# EAGLE design led28 (EAGLE 6.2)
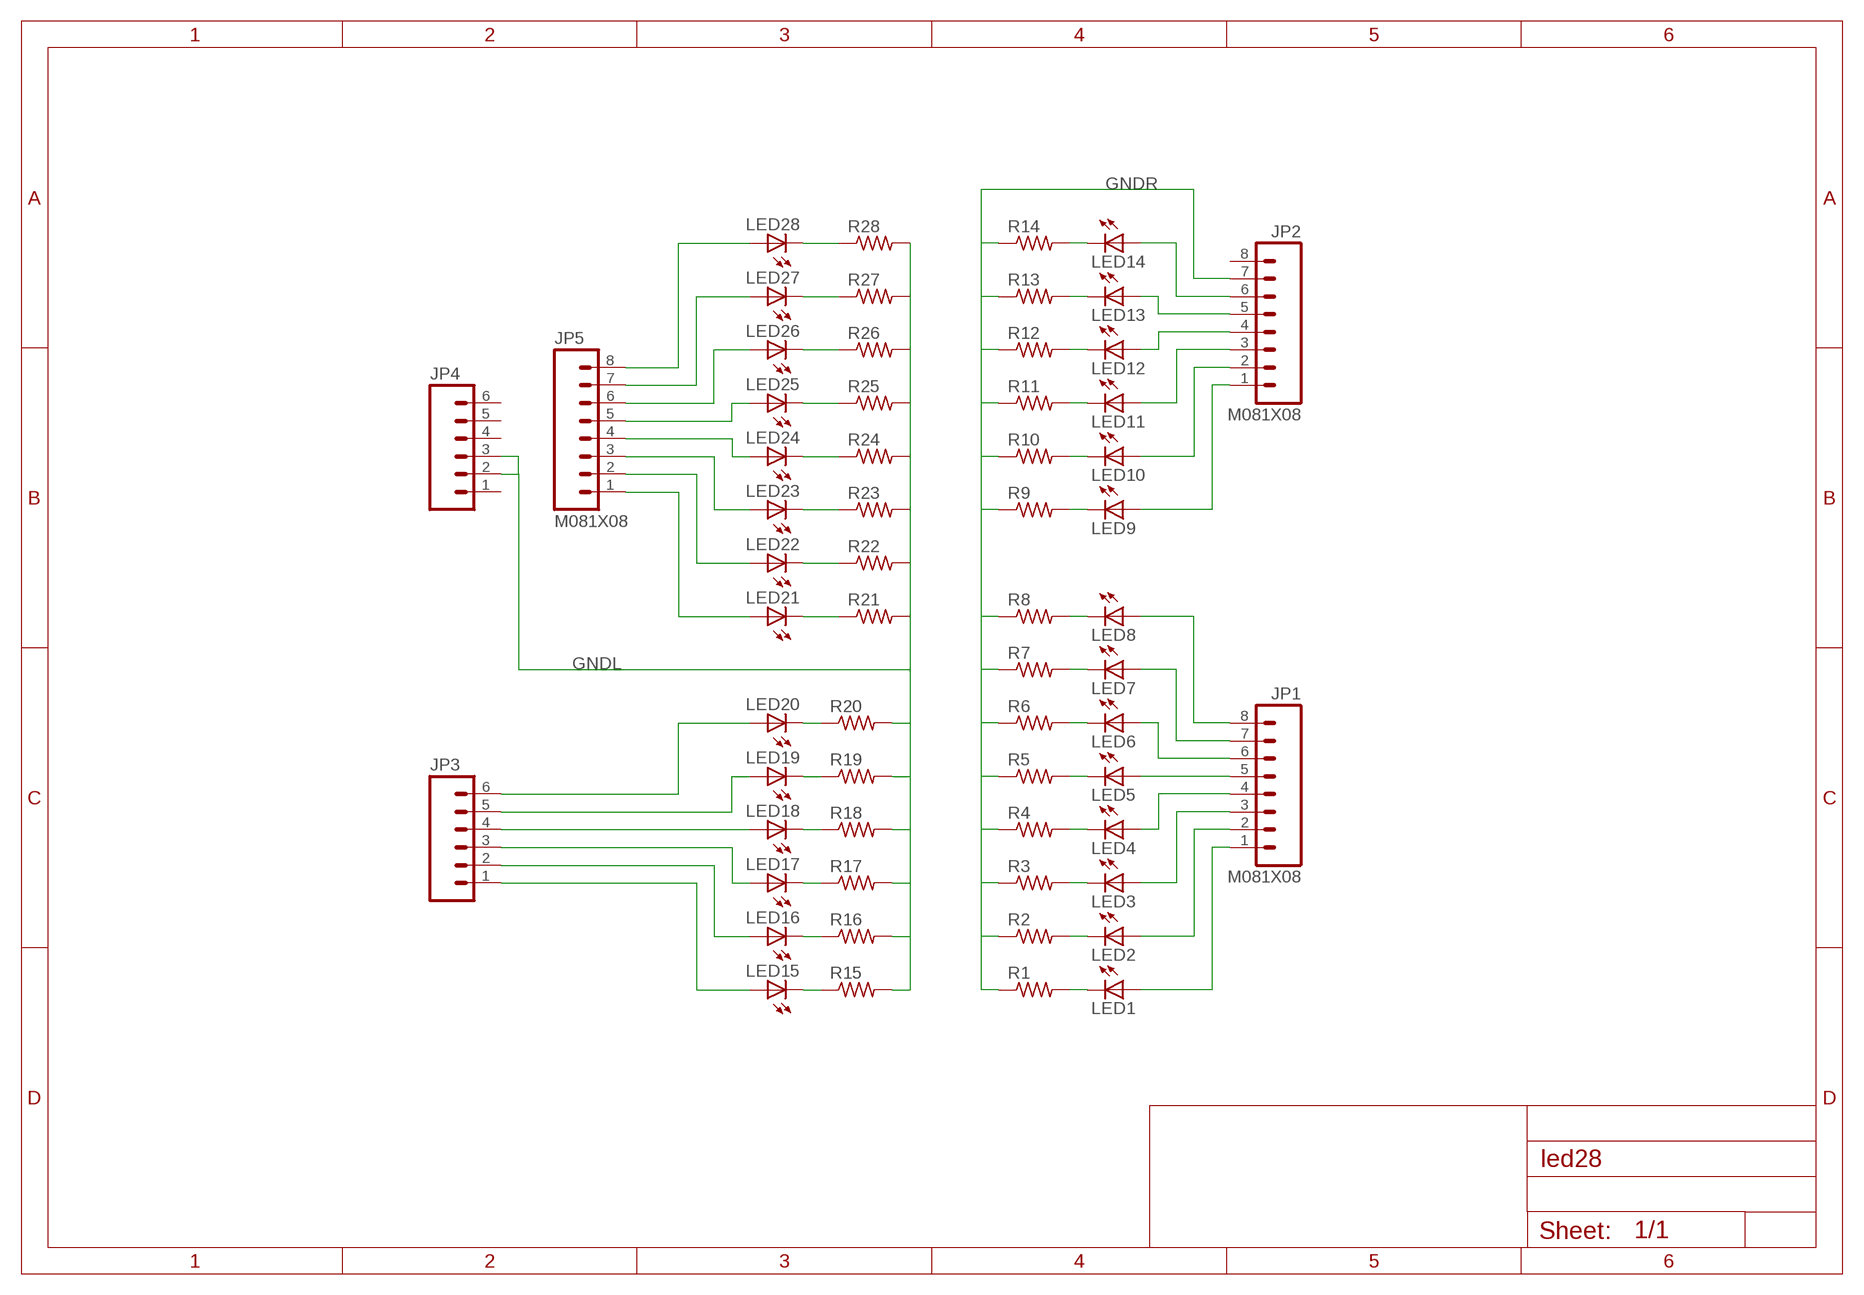
[diagram p0: schematic, sheet 1]

## Parts
JP1  M081X08  [1X08_NARROW]
JP2  M081X08  [1X08_NARROW]
JP3  M06SIP  [1X06_NARROW]
JP4  M06SIP  [1X06_NARROW]
JP5  M081X08  [1X08_NARROW]
LED1  LEDCHIP-LED0603  [CHIP-LED0603]
LED2  LEDCHIP-LED0603  [CHIP-LED0603]
LED3  LEDCHIP-LED0603  [CHIP-LED0603]
LED4  LEDCHIP-LED0603  [CHIP-LED0603]
LED5  LEDCHIP-LED0603  [CHIP-LED0603]
LED6  LEDCHIP-LED0603  [CHIP-LED0603]
LED7  LEDCHIP-LED0603  [CHIP-LED0603]
LED8  LEDCHIP-LED0603  [CHIP-LED0603]
LED9  LEDCHIP-LED0603  [CHIP-LED0603]
LED10  LEDCHIP-LED0603  [CHIP-LED0603]
LED11  LEDCHIP-LED0603  [CHIP-LED0603]
LED12  LEDCHIP-LED0603  [CHIP-LED0603]
LED13  LEDCHIP-LED0603  [CHIP-LED0603]
LED14  LEDCHIP-LED0603  [CHIP-LED0603]
LED15  LEDCHIP-LED0603  [CHIP-LED0603]
LED16  LEDCHIP-LED0603  [CHIP-LED0603]
LED17  LEDCHIP-LED0603  [CHIP-LED0603]
LED18  LEDCHIP-LED0603  [CHIP-LED0603]
LED19  LEDCHIP-LED0603  [CHIP-LED0603]
LED20  LEDCHIP-LED0603  [CHIP-LED0603]
LED21  LEDCHIP-LED0603  [CHIP-LED0603]
LED22  LEDCHIP-LED0603  [CHIP-LED0603]
LED23  LEDCHIP-LED0603  [CHIP-LED0603]
LED24  LEDCHIP-LED0603  [CHIP-LED0603]
LED25  LEDCHIP-LED0603  [CHIP-LED0603]
LED26  LEDCHIP-LED0603  [CHIP-LED0603]
LED27  LEDCHIP-LED0603  [CHIP-LED0603]
LED28  LEDCHIP-LED0603  [CHIP-LED0603]
R1  R-US_R0603  [R0603]
R2  R-US_R0603  [R0603]
R3  R-US_R0603  [R0603]
R4  R-US_R0603  [R0603]
R5  R-US_R0603  [R0603]
R6  R-US_R0603  [R0603]
R7  R-US_R0603  [R0603]
R8  R-US_R0603  [R0603]
R9  R-US_R0603  [R0603]
R10  R-US_R0603  [R0603]
R11  R-US_R0603  [R0603]
R12  R-US_R0603  [R0603]
R13  R-US_R0603  [R0603]
R14  R-US_R0603  [R0603]
R15  R-US_R0603  [R0603]
R16  R-US_R0603  [R0603]
R17  R-US_R0603  [R0603]
R18  R-US_R0603  [R0603]
R19  R-US_R0603  [R0603]
R20  R-US_R0603  [R0603]
R21  R-US_R0603  [R0603]
R22  R-US_R0603  [R0603]
R23  R-US_R0603  [R0603]
R24  R-US_R0603  [R0603]
R25  R-US_R0603  [R0603]
R26  R-US_R0603  [R0603]
R27  R-US_R0603  [R0603]
R28  R-US_R0603  [R0603]

## Nets
GNDL: JP4.2 JP4.3 R15.2 R16.2 R17.2 R18.2 R19.2 R20.2 R21.2 R22.2 R23.2 R24.2 R25.2 R26.2 R27.2 R28.2
GNDR: JP2.7 R1.1 R2.1 R3.1 R4.1 R5.1 R6.1 R7.1 R8.1 R9.1 R10.1 R11.1 R12.1 R13.1 R14.1
N$1: JP1.5 LED5.A
N$2: JP1.4 LED4.A
N$3: JP1.3 LED3.A
N$4: JP1.2 LED2.A
N$5: JP1.1 LED1.A
N$6: JP1.6 LED6.A
N$7: JP1.7 LED7.A
N$8: JP1.8 LED8.A
N$9: LED1.C R1.2
N$10: LED2.C R2.2
N$11: LED3.C R3.2
N$12: LED4.C R4.2
N$13: LED5.C R5.2
N$14: LED6.C R6.2
N$15: LED7.C R7.2
N$18: LED8.C R8.2
N$20: LED9.C R9.2
N$21: LED10.C R10.2
N$22: LED11.C R11.2
N$23: LED12.C R12.2
N$24: LED13.C R13.2
N$28: LED14.C R14.2
N$29: JP2.4 LED12.A
N$30: JP2.3 LED11.A
N$31: JP2.2 LED10.A
N$32: JP2.1 LED9.A
N$33: JP2.5 LED13.A
N$34: JP2.6 LED14.A
N$35: LED15.C R15.1
N$36: LED16.C R16.1
N$40: LED17.C R17.1
N$41: LED18.C R18.1
N$42: LED19.C R19.1
N$44: LED20.C R20.1
N$49: LED21.C R21.1
N$54: LED22.C R22.1
N$55: LED23.C R23.1
N$56: LED24.C R24.1
N$60: LED25.C R25.1
N$61: LED26.C R26.1
N$65: LED27.C R27.1
N$66: LED28.C R28.1
N$68: JP3.4 LED18.A
N$73: JP3.3 LED17.A
N$74: JP3.2 LED16.A
N$75: JP3.1 LED15.A
N$78: JP5.4 LED24.A
N$79: JP5.3 LED23.A
N$80: JP5.2 LED22.A
N$84: JP5.1 LED21.A
N$85: JP5.5 LED25.A
N$87: JP5.6 LED26.A
N$90: JP5.7 LED27.A
N$92: JP5.8 LED28.A
N$98: JP3.5 LED19.A
N$99: JP3.6 LED20.A
Unconnected: JP2.8 JP4.1 JP4.4 JP4.5 JP4.6

## Library data of the parts
JP1 JP2 JP5 = led28:M08: Header 8 Standard 8-pin 0.1" header. Use with straight break away headers (SKU : PRT-00116), right angle break away headers (PRT-00553), swiss pins (PRT-00743), machine pins (PRT-00117), and female headers (PRT-00115).
JP3 JP4 = led28:M06: Header 6 Standard 6-pin 0.1" header. Use with straight break away headers (SKU : PRT-00116), right angle break away headers (PRT-00553), swiss pins (PRT-00743), machine pins (PRT-00117), and female headers (PRT-00115). Molex polarized connector foot print use with SKU : PRT-08094 with associated crimp pins and housings. NOTES ON THE VARIANTS LOCK and LOCK_LONGPADS... This footprint was designed to help hold the alignment of a through-hole component (i.e. 6-pin header) while soldering it into place. You may notice that each hole has been shifted either up or down by 0.005 of an inch from it's more standard position (which is a perfectly straight line). This slight alteration caused the pins (the squares in the middle) to touch the edges of the holes. Because they are alternating, it causes a "brace" to hold the component in place. 0.005 has proven to be the perfect amount of "off-center" position when using our standard breakaway headers. Although looks a little odd when you look at the bare footprint, once you have a header in there, the alteration is very hard to notice. Also, if you push a header all the way into place, it is covered up entirely on the bottom side. This idea of altering the position of holes to aid alignment will be further integrated into the Sparkfun Library for other footprints. It can help hold any component with 3 or more connection pins.
LED1-LED28 = led:LED: LED OSRAM: - CHIPLED LG R971, LG N971, LY N971, LG Q971, LY Q971, LO R971, LY R971 LH N974, LH R974 LS Q976, LO Q976, LY Q976 LO Q996 - Hyper CHIPLED LW Q18S LB Q993, LB Q99A, LB R99A - SideLED LS A670, LO A670, LY A670, LG A670, LP A670 LB A673, LV A673, LT A673, LW A673 LH A674 LY A675 LS A676, LA A676, LO A676, LY A676, LW A676 LS A679, LY A679, LG A679 - Hyper Micro SIDELED® LS Y876, LA Y876, LO Y876, LY Y876 LT Y87S - SmartLED LW L88C, LW L88S LB L89C, LB L89S, LG L890 LS L89K, LO L89K, LY L89K LS L896, LA L896, LO L896, LY L896 - TOPLED LS T670, LO T670, LY T670, LG T670, LP T670 LSG T670, LSP T670, LSY T670, LOP T670, LYG T670 LG T671, LOG T671, LSG T671 LB T673, LV T673, LT T673, LW T673 LH T674 LS T676, LA T676, LO T676, LY T676, LB T676, LH T676, LSB T676, LW T676 LB T67C, LV T67C, LT T67C, LS T67K, LO T67K, LY T67K, LW E67C LS E67B, LA E67B, LO E67B, LY E67B, LB E67C, LV E67C, LT E67C LW T67C LS T679, LY T679, LG T679 LS T770, LO T770, LY T770, LG T770, LP T770 LB T773, LV T773, LT T773, LW T773 LH T774 LS E675, LA E675, LY E675, LS T675 LS T776, LA T776, LO T776, LY T776, LB T776 LHGB T686 LT T68C, LB T68C - Hyper Mini TOPLED® LB M676 - Mini TOPLED Santana® LG M470 LS M47K, LO M47K, LY M47K Source: http://www.osram.convergy.de LUXEON: - LUMILED® LXK2-PW12-R00, LXK2-PW12-S00, LXK2-PW14-U00, LXK2-PW14-V00 LXK2-PM12-R00, LXK2-PM12-S00, LXK2-PM14-U00 LXK2-PE12-Q00, LXK2-PE12-R00, LXK2-PE12-S00, LXK2-PE14-T00, LXK2-PE14-U00 LXK2-PB12-K00, LXK2-PB12-L00, LXK2-PB12-M00, LXK2-PB14-N00, LXK2-PB14-P00, LXK2-PB14-Q00 LXK2-PR12-L00, LXK2-PR12-M00, LXK2-PR14-Q00, LXK2-PR14-R00 LXK2-PD12-Q00, LXK2-PD12-R00, LXK2-PD12-S00 LXK2-PH12-R00, LXK2-PH12-S00 LXK2-PL12-P00, LXK2-PL12-Q00, LXK2-PL12-R00 Source: www.luxeon.com KINGBRIGHT: KA-3528ASYC Source: www.kingbright.com
R1-R28 = rcl:R-US_: RESISTOR, American symbol

## Board
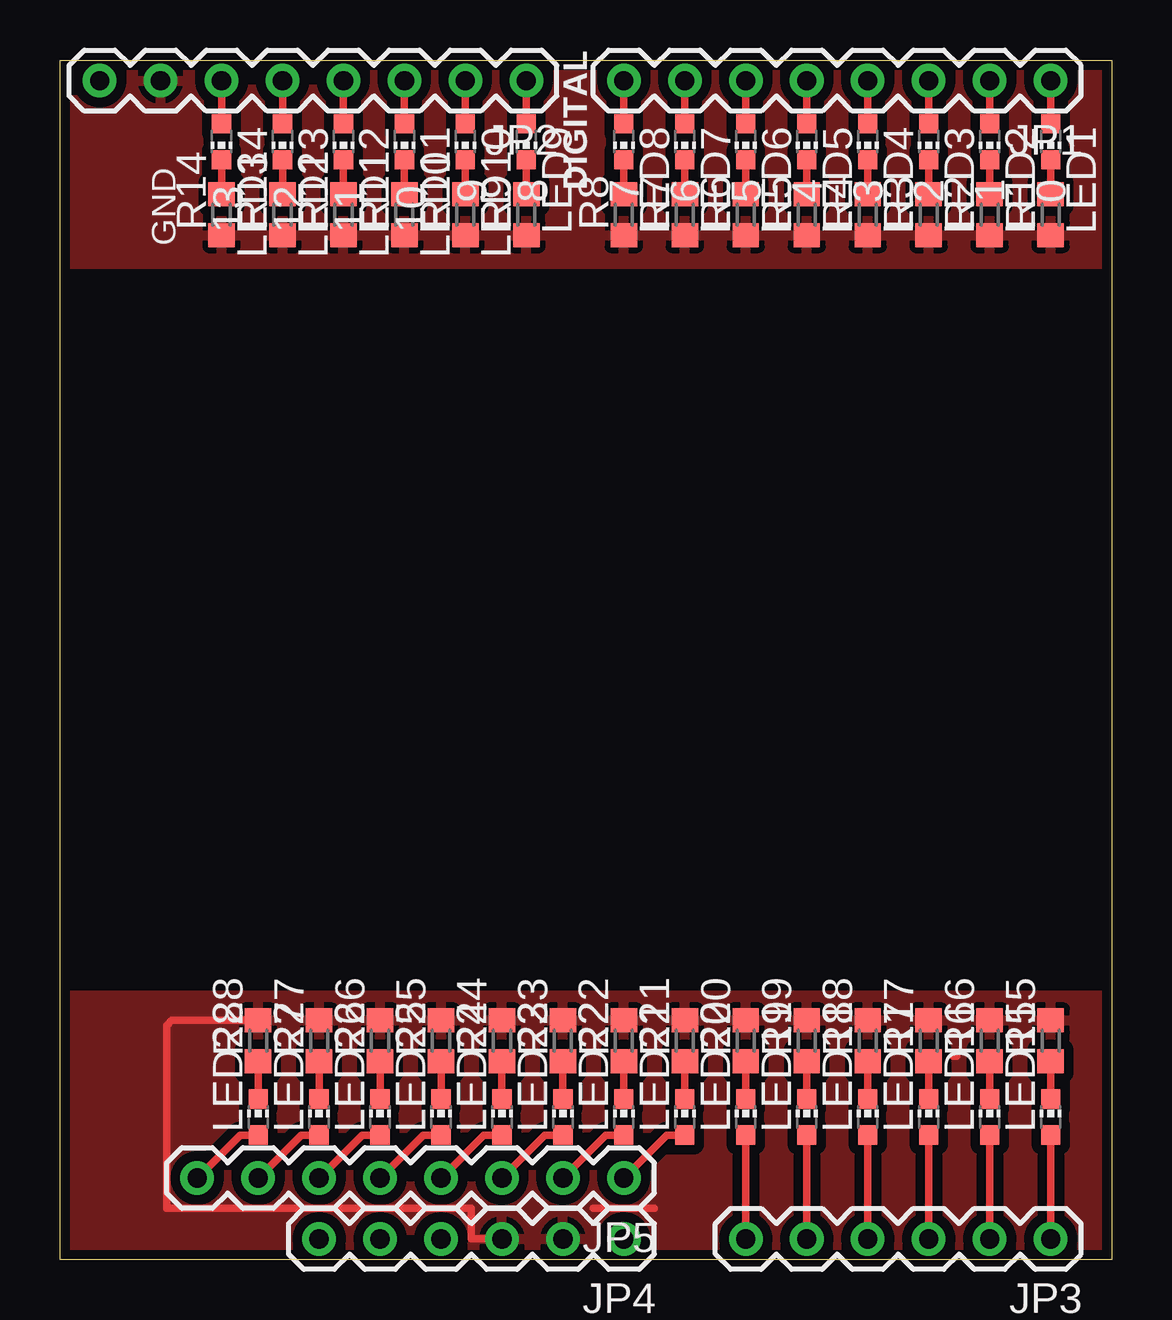
[diagram p1: board, top side]
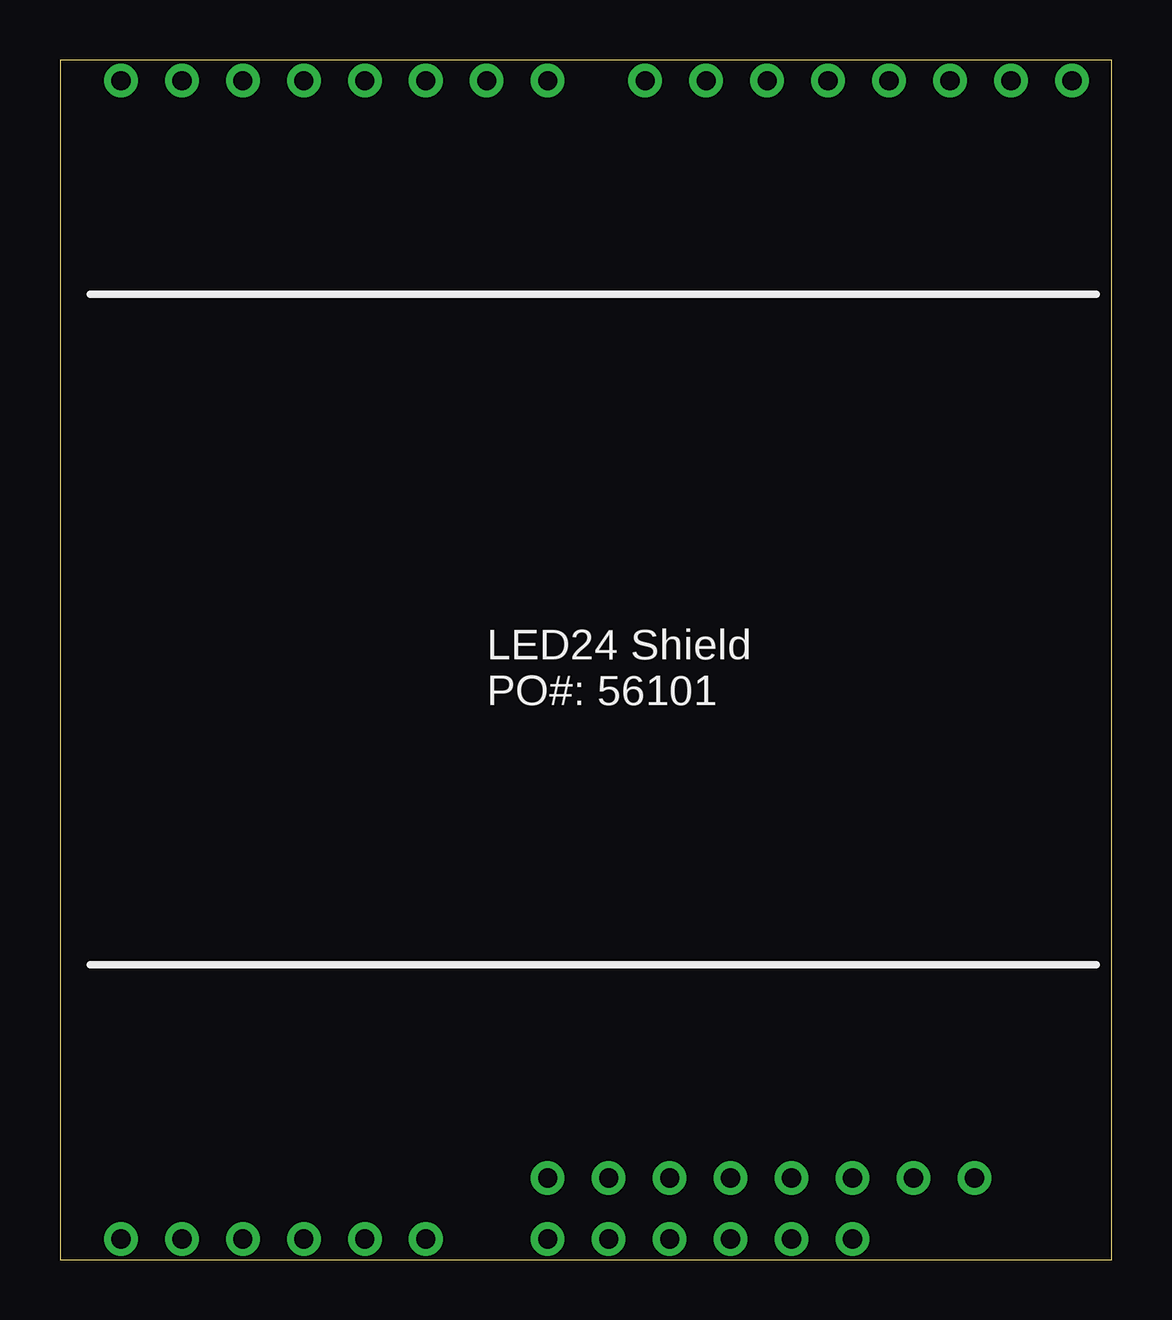
[diagram p2: board, bottom side, seen from below]

Size 43.82 x 49.99 mm. Coordinates in mm from the lower left corner, seen from the top.
Outline: 43.82,49.99 43.82,0 0,0 0,49.99 43.82,49.99
Copper layers (1*16): Top 0.035mm / dielectric 1.5mm / Bottom 0.035mm
Design rules: minimum track width 6mil, minimum drill 12mil, track to track 6mil, track to pad 6mil, pad to pad 6mil, via to via 6mil, smd to smd 0mil, copper to edge 10mil, drill to drill 10mil, minimum pad ring 10mil, minimum via ring 6mil, stop-mask expansion 2mil, vias tented up to drill 100mil, thermal gap 10mil

### Footprints (pad centres in the part's own frame; a part is rotated, then mirrored left to right if it is on the bottom)
1X08_NARROW = drill 0.8 pad 1.397: 1 0,0; 2 2.54,0; 3 5.08,0; 4 7.62,0; 5 10.16,0; 6 12.7,0; 7 15.24,0; 8 17.78,0
1X06_NARROW = drill 0.8 pad 1.397: 1 0,0; 2 2.54,0; 3 5.08,0; 4 7.62,0; 5 10.16,0; 6 12.7,0
CHIP-LED0603 = smd 0.8 x 0.8: A 0,-0.75; C 0,0.75
R0603 = smd 1 x 1.1: 1 -0.85,0; 2 0.85,0

### Placement (x,y rotation side)
JP1  41.27,49.12 180 top
JP2  19.43,49.12 180 top
JP3  41.27,0.86 180 top
JP4  23.49,0.86 180 top
JP5  23.49,3.4 180 top
LED1  41.27,46.58 180 top
LED2  38.73,46.58 180 top
LED3  36.2,46.58 180 top
LED4  33.66,46.58 180 top
LED5  31.12,46.58 180 top
LED6  28.57,46.58 180 top
LED7  26.03,46.58 180 top
LED8  23.49,46.58 180 top
LED9  19.43,46.58 180 top
LED10  16.89,46.58 180 top
LED11  14.35,46.58 180 top
LED12  11.81,46.58 180 top
LED13  9.27,46.58 180 top
LED14  6.73,46.58 180 top
LED15  41.27,5.94 0 top
LED16  38.73,5.94 0 top
LED17  36.2,5.94 0 top
LED18  33.66,5.94 0 top
LED19  31.12,5.94 0 top
LED20  28.57,5.94 0 top
LED21  26.03,5.94 0 top
LED22  23.49,5.94 0 top
LED23  20.95,5.94 0 top
LED24  18.41,5.94 0 top
LED25  15.88,5.94 0 top
LED26  13.34,5.94 0 top
LED27  10.8,5.94 0 top
LED28  8.25,5.94 0 top
R1  41.27,43.54 90 top
R2  38.73,43.54 90 top
R3  36.2,43.54 90 top
R4  33.66,43.54 90 top
R5  31.12,43.54 90 top
R6  28.57,43.54 90 top
R7  26.03,43.54 90 top
R8  23.49,43.54 90 top
R9  19.43,43.54 90 top
R10  16.89,43.54 90 top
R11  14.35,43.54 90 top
R12  11.81,43.54 90 top
R13  9.27,43.54 90 top
R14  6.73,43.54 90 top
R15  41.27,9.12 90 top
R16  38.73,9.12 90 top
R17  36.2,9.12 90 top
R18  33.66,9.12 90 top
R19  31.12,9.12 90 top
R20  28.57,9.12 90 top
R21  26.03,9.12 90 top
R22  23.49,9.12 90 top
R23  20.95,9.12 90 top
R24  18.41,9.12 90 top
R25  15.88,9.12 90 top
R26  13.34,9.12 90 top
R27  10.8,9.12 90 top
R28  8.25,9.12 90 top

### Tracks (layer width: path | path; a pad name or v marks a point on that pad's centre or on a via)
GNDL
  Top 0.305: 37.21,8.48 37.35,8.48 | R28.2 4.66,9.97 4.45,9.75 4.45,2.13 17.14,2.13 17.14,0.86 JP4.3 | 24.77,2.13 22.23,2.13
  pour Top (isolate 0.406): 0,11.02 43.82,11.02 43.82,-0.41 0,-0.41
GNDR
  pour Top (isolate 0.406): 0,41.5 43.82,41.5 43.82,50.39 0,50.39
N$1
  Top 0.305: LED5.A JP1.5
N$2
  Top 0.305: LED4.A JP1.4
N$3
  Top 0.305: LED3.A JP1.3
N$4
  Top 0.305: LED2.A JP1.2
N$5
  Top 0.305: LED1.A JP1.1
N$6
  Top 0.305: LED6.A JP1.6
N$7
  Top 0.305: LED7.A JP1.7
N$8
  Top 0.305: LED8.A JP1.8
N$9
  Top 0.305: R1.2 LED1.C
N$10
  Top 0.305: R2.2 LED2.C
N$11
  Top 0.305: R3.2 LED3.C
N$12
  Top 0.305: R4.2 LED4.C
N$13
  Top 0.305: R5.2 LED5.C
N$14
  Top 0.305: R6.2 LED6.C
N$15
  Top 0.305: R7.2 LED7.C
N$18
  Top 0.305: R8.2 LED8.C
N$20
  Top 0.305: R9.2 LED9.C
N$21
  Top 0.305: R10.2 LED10.C
N$22
  Top 0.305: R11.2 LED11.C
N$23
  Top 0.305: R12.2 LED12.C
N$24
  Top 0.305: R13.2 LED13.C
N$28
  Top 0.305: R14.2 LED14.C
N$29
  Top 0.305: LED12.A JP2.4
N$30
  Top 0.305: LED11.A JP2.3
N$31
  Top 0.305: LED10.A JP2.2
N$32
  Top 0.305: LED9.A JP2.1
N$33
  Top 0.305: LED13.A JP2.5
N$34
  Top 0.305: LED14.A JP2.6
N$35
  Top 0.305: LED15.C R15.1
N$36
  Top 0.305: LED16.C R16.1
N$40
  Top 0.305: LED17.C R17.1
N$41
  Top 0.305: LED18.C R18.1
N$42
  Top 0.305: LED19.C R19.1
N$44
  Top 0.305: LED20.C R20.1
N$49
  Top 0.305: LED21.C R21.1
N$54
  Top 0.305: LED22.C R22.1
N$55
  Top 0.305: LED23.C R23.1
N$56
  Top 0.305: LED24.C R24.1
N$60
  Top 0.305: LED25.C R25.1
N$61
  Top 0.305: LED26.C R26.1
N$65
  Top 0.305: LED27.C R27.1
N$66
  Top 0.305: LED28.C R28.1
N$68
  Top 0.305: LED18.A JP3.4
N$73
  Top 0.305: LED17.A JP3.3
N$74
  Top 0.305: LED16.A JP3.2
N$75
  Top 0.305: LED15.A JP3.1
N$78
  Top 0.305: LED24.A 17.66,5.19 JP5.4
N$79
  Top 0.305: LED23.A 20.2,5.19 JP5.3
N$80
  Top 0.305: LED22.A 22.74,5.19 JP5.2
N$84
  Top 0.305: LED21.A 25.28,5.19 JP5.1
N$85
  Top 0.305: LED25.A 15.12,5.19 JP5.5
N$87
  Top 0.305: LED26.A 12.59,5.19 JP5.6
N$90
  Top 0.305: LED27.A 10.05,5.19 JP5.7
N$92
  Top 0.305: LED28.A 7.5,5.19 JP5.8
N$98
  Top 0.305: LED19.A JP3.5
N$99
  Top 0.305: LED20.A JP3.6

### Text on the board
tPlace: 9 | 8 | 7 | 6 | 5 | 4 | 3 | 2 | 1 | 0 | 13 | 12 | 11 | 10
bPlace: LED24 Shield | PO#: 56101
tNames: DIGITAL | GND
Reference: USB | ETH